# Altium schematic sheet Shield.SchDoc
size A; SheetNumber: 1; SheetTotal: 1
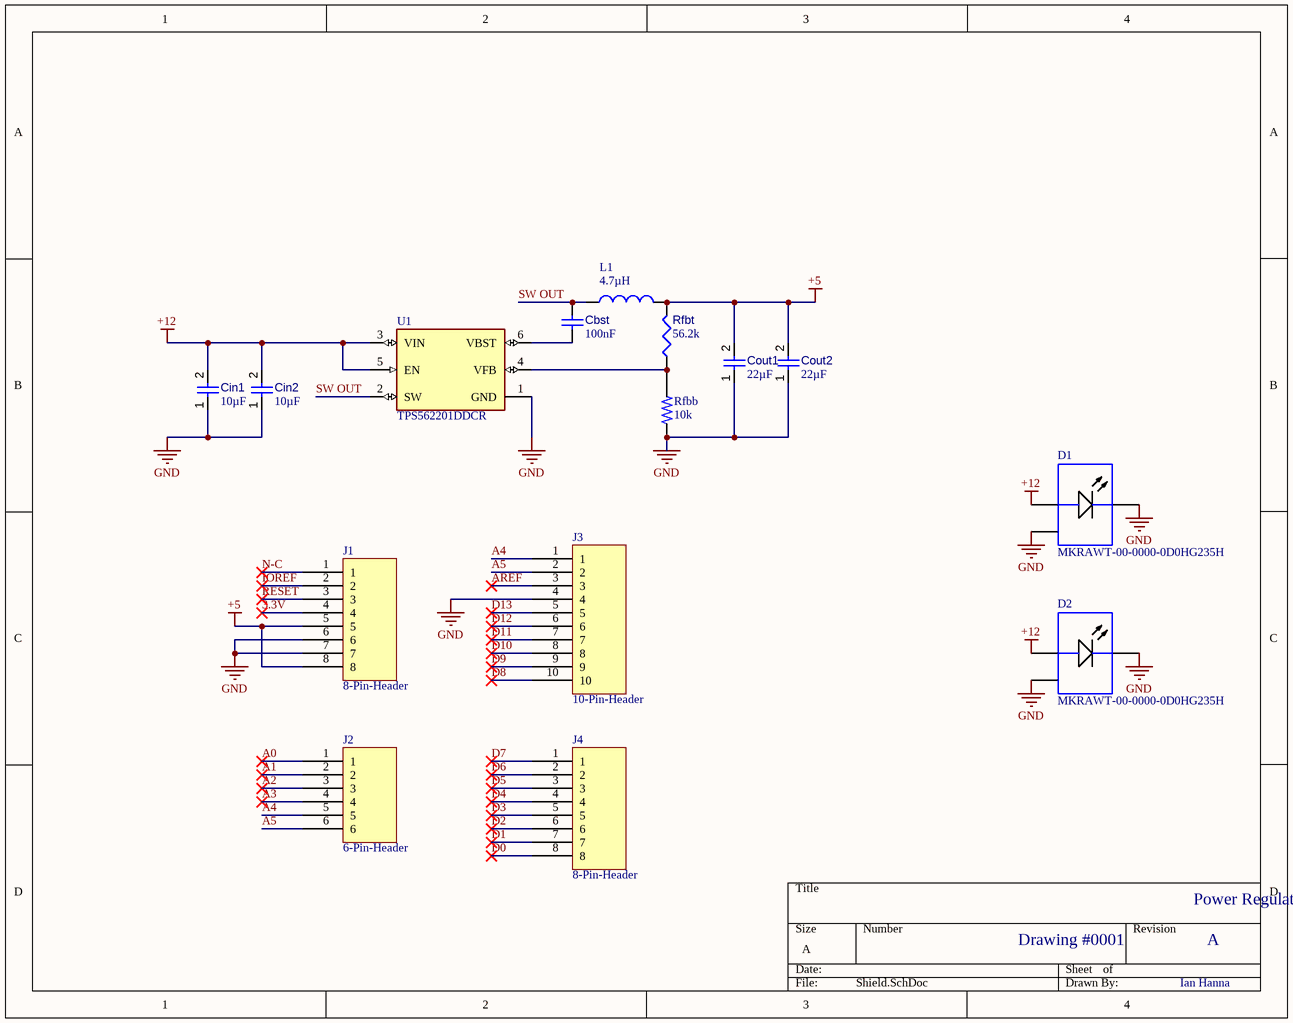
[diagram p0: Shield.SchDoc]

## Parts
Cbst  value 100nF  [C0805]  (hidden comment: 08053C104KAT2A)
Cin1  value 10µF  [C0805]  (hidden comment: MSAST219LB5106KTNA01)
Cin2  value 10µF  [C0805]  (hidden comment: MSAST219LB5106KTNA01)
Cout1  value 22µF  [C0805]  (hidden comment: MSASL219LB5226MTNA01)
Cout2  value 22µF  [C0805]  (hidden comment: MSASL219LB5226MTNA01)
D1  MKRAWT-00-0000-0D0HG235H  [CREE-MK-R-2_V]
D2  MKRAWT-00-0000-0D0HG235H  [CREE-MK-R-2_V]
J1  8-Pin-Header  [8-Pin-Header-Footprint-1]
J2  6-Pin-Header  [6-Pin-Header-Footprint-1]
J3  10-Pin-Header  [10-Pin-Header-Footprint-1]
J4  8-Pin-Header  [8-Pin-Header-Footprint-1]
L1  value 4.7µH  [SRN6045]  (hidden comment: SRN6045-4R7Y)
Rfbb  value 10k  [RESC0603X26N]  (hidden comment: RC0201FR-0710KL)
Rfbt  value 56.2k  [RESC0603X26N]  (hidden comment: RC0201FR-0756K2L)
U1  TPS562201DDCR  [FP-DDC0006A-IPC_C]

## Nets
+5: Cout1.2 Cout2.2 J1.5 J1.8 L1.2 Rfbt.2
+12: Cin1.2 Cin2.2 D1.1(A) D2.1(A) U1.3(VIN) U1.5(EN)
GND: Cin1.1 Cin2.1 Cout1.1 Cout2.1 D1.2(K) D1.3(EP) D2.2(K) D2.3(EP) J1.6 J1.7 J3.4 Rfbb.1 U1.1(GND)
3.3V: J1.4
A0: J2.1
A1: J2.2
A2: J2.3
A3: J2.4
A4: J2.5 J3.1
A5: J2.6 J3.2
AREF: J3.3
D0: J4.8
D1: J4.7
D2: J4.6
D3: J4.5
D4: J4.4
D5: J4.3
D6: J4.2
D7: J4.1
D8: J3.10
D9: J3.9
D10: J3.8
D11: J3.7
D12: J3.6
D13: J3.5
IOREF: J1.2
N-C: J1.1
RESET: J1.3
SW OUT: Cbst.1 L1.1 U1.2(SW)
NetCbst_2: Cbst.2 U1.6(VBST)
NetRfbb_2: Rfbb.2 Rfbt.1 U1.4(VFB)

## Notes on the sheet
- Power Regulator + LED Shield PCB for Arduino Uno
- Drawing #0001
- A
- Ian Hanna

## Library data of the parts
Cbst = CMP-001-00084-2: 0805 100 nF 25V ±10 % Tolerance X7R Surface Mount Multilayer Ceramic Capacitor; Tolerance: 10%; Mounting Technology: Surface Mount; Min Operating Temperature: -55°C; Case/Package: 0805; Max Operating Temperature: 125°C; Voltage Rating: 25V; Pins: 2
Cin1 Cin2 = CMP-001-00083-2: Ceramic Capacitor, Multilayer, Ceramic, 25V, 10% +Tol, 10% -Tol, X5R, 15% TC, 10uF, Surface Mount, 0805; Dielectric Material: Ceramic; Min Operating Temperature: -55°C; Length: 2mm; REACH SVHC: Yes; Height: 850µm; Voltage Rating (DC): 25V; Number of Terminals: 2; RoHS: Compliant; Max Operating Temperature: 85°C; Width: 1.25mm; Mounting Technology: Surface Mount; Lifecycle Status: Production
Cout1 Cout2 = CMP-001-00085-3: Ceramic Capacitor, Multilayer, Ceramic, 10V, 20% +Tol, 20% -Tol, X5R, 15% TC, 22uF, Surface Mount, 0805; Min Operating Temperature: -55°C; Max Operating Temperature: 85°C; Mounting Technology: Surface Mount
D1 D2 = CMP-2100-00977-1: LED, White, 12 V, 2-Pin SMD, RoHS, Tape and Reel
J1 J4 = CMP-00004-1: Manufacturer Lifecycle Status: PRODUCTION; Connector Type: Receptacle, Socket; Pitch: 2.54mm; Number of Contacts: 8; Voltage Rating (DC): 655V; Voltage Rating (AC): 465V; Lead Free: Lead Free; Width: 2.41mm; Housing Color: Black; Length: 20.8mm; Radiation Hardening: No; Height: 8.51mm; Lifecycle Status: Production; Packaging: Bulk; Housing Material: Plastic; RoHS: Compliant; Number of Rows: 1; Mounting Technology: Through Hole; Color: Black; Contact Plating: Tin; Termination: Solder; Contact Material: Bronze; Number of Positions: 8
J2 = CMP-00003-1: Manufacturer Lifecycle Status: PRODUCTION; Number of Contacts: 6; Voltage Rating: 655V; Voltage Rating (AC): 465V; Connector Type: Receptacle, Socket; Pitch: 2.54mm; Current Rating: 6.3A; Number of Rows: 1; Color: Black; Lifecycle Status: Production; Termination: Solder; Radiation Hardening: No; Housing Material: Plastic; Voltage Rating (DC): 655V; Contact Material: Nickel, Tin; Mounting Technology: Through Hole; Housing Color: Black; Width: 2.41mm; Max Operating Temperature: 105°C; Lead Free: Lead Free; Min Operating Temperature: -55°C; RoHS: Compliant; Height: 8.64mm; Contact Plating: Tin; Length: 15.8mm; Number of Positions: 6; Packaging: Bulk
J3 = CMP-00005-2: Manufacturer Lifecycle Status: PRODUCTION; Number of Contacts: 10; Current Rating: 6.3A; Pitch: 2.54mm; Connector Type: Receptacle, Socket; Voltage Rating (AC): 465V; Voltage Rating: 655V; Width: 2.41mm; Termination: Solder; Number of Positions: 10; Housing Material: Plastic; Color: Black; Lifecycle Status: Production; Max Operating Temperature: 105°C; RoHS: Compliant; Pins: 10; Lead Free: Lead Free; Contact Plating: Tin; Housing Color: Black; Number of Rows: 1; Mounting Technology: Through Hole; Voltage Rating (DC): 655V; Packaging: Bulk; Contact Material: Nickel, Tin; Length: 25.9mm; Min Operating Temperature: -55°C; Radiation Hardening: No; Height: 8.64mm
L1 = CMP-006-00021-2: Inductor Power Semi-Shielded Wirewound 4.7uH 30% 100KHz 15Q-Factor Ferrite 3A 37.6mOhm DCR T/R; Self Resonant Frequency: 22MHz; Current Rating: 3A; Max Operating Temperature: 125°C; Mounting Technology: Surface Mount; Min Operating Temperature: -40°C; Pins: 2; Max Current Rating: 3A; Tolerance: 30%; Case/Package: 2424
Rfbb = CMP-009-00197-1: 10 kOhms Â±1% 0.05W, 1/20W Chip Resistor 0201 (0603 Metric) Moisture Resistant Thick Film; MF: Yageo; Case/Package: 0201 Yageo; Design Item ID: RC0201FR-0710KL; Component Type: Standard; Source: RC0201FR-0710KL.SchLib; Check_prices: https://www.snapeda.com/parts/RC0201FR-0710KL/Yageo/view-part/?ref=eda; Pins: 2; SnapEDA_Link: https://www.snapeda.com/parts/RC0201FR-0710KL/Yageo/view-part/?ref=snap; MP: RC0201FR-0710KL
Rfbt = CMP-009-00178-2: Res Thick Film 0201 56.2K Ohm 1% 0.05W(1/20W) ±200ppm/C Molded SMD Paper T/R; Voltage Rating: 25V; Case/Package: 0201; Max Operating Temperature: 125°C; Tolerance: 1%; Mounting Technology: Surface Mount; Min Operating Temperature: -55°C
U1 = CMP-04918-000361-1: IC REG BUCK ADJ 2A TSOT23-6; Switching Frequency: 580kHz; Max Input Voltage: 17V; Number of Outputs: 1; Output Voltage: 7V; Output Type: Adjustable; Quiescent Current: 400uA; Min Input Voltage: 4.5V; Mount: Surface Mount; Max Operating Temperature: 125°C; Lead Free: Lead Free; Operating Supply Voltage: 17V; Number of Pins: 6; RoHS Compliant: Yes; Contact Plating: Tin; Min Operating Temperature: -40°C; Case/Package: SOT; Max Output Current: 2A